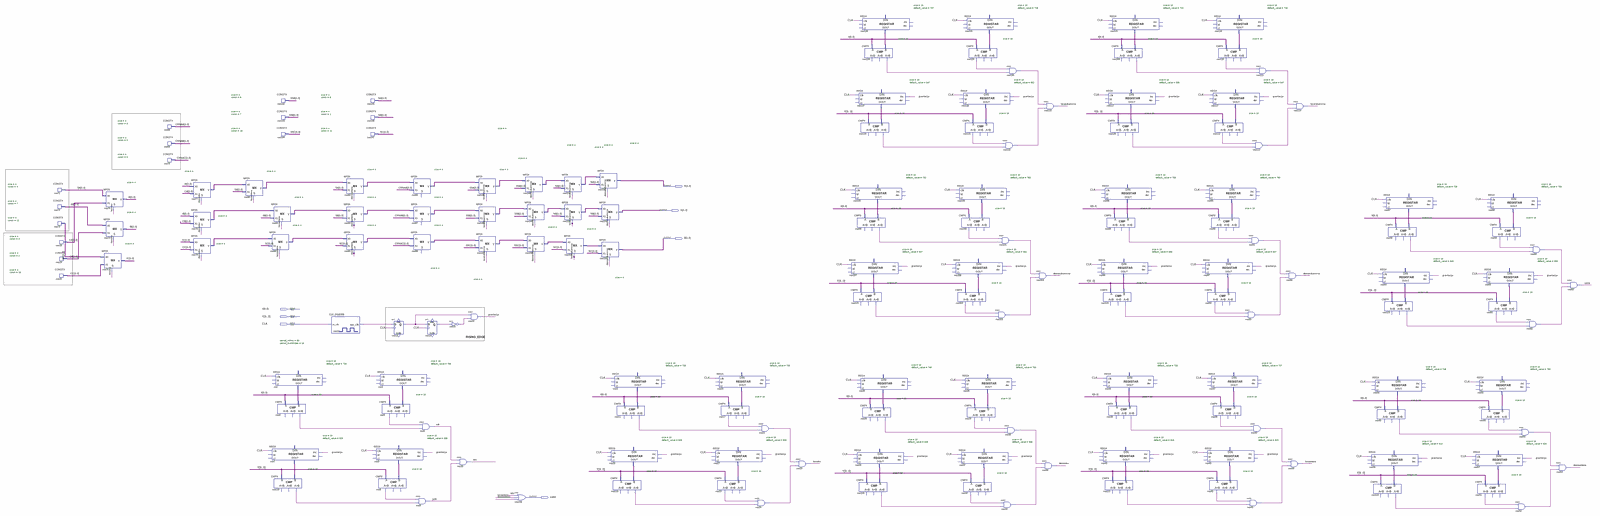
[diagram p0: schematic sheet, whole]
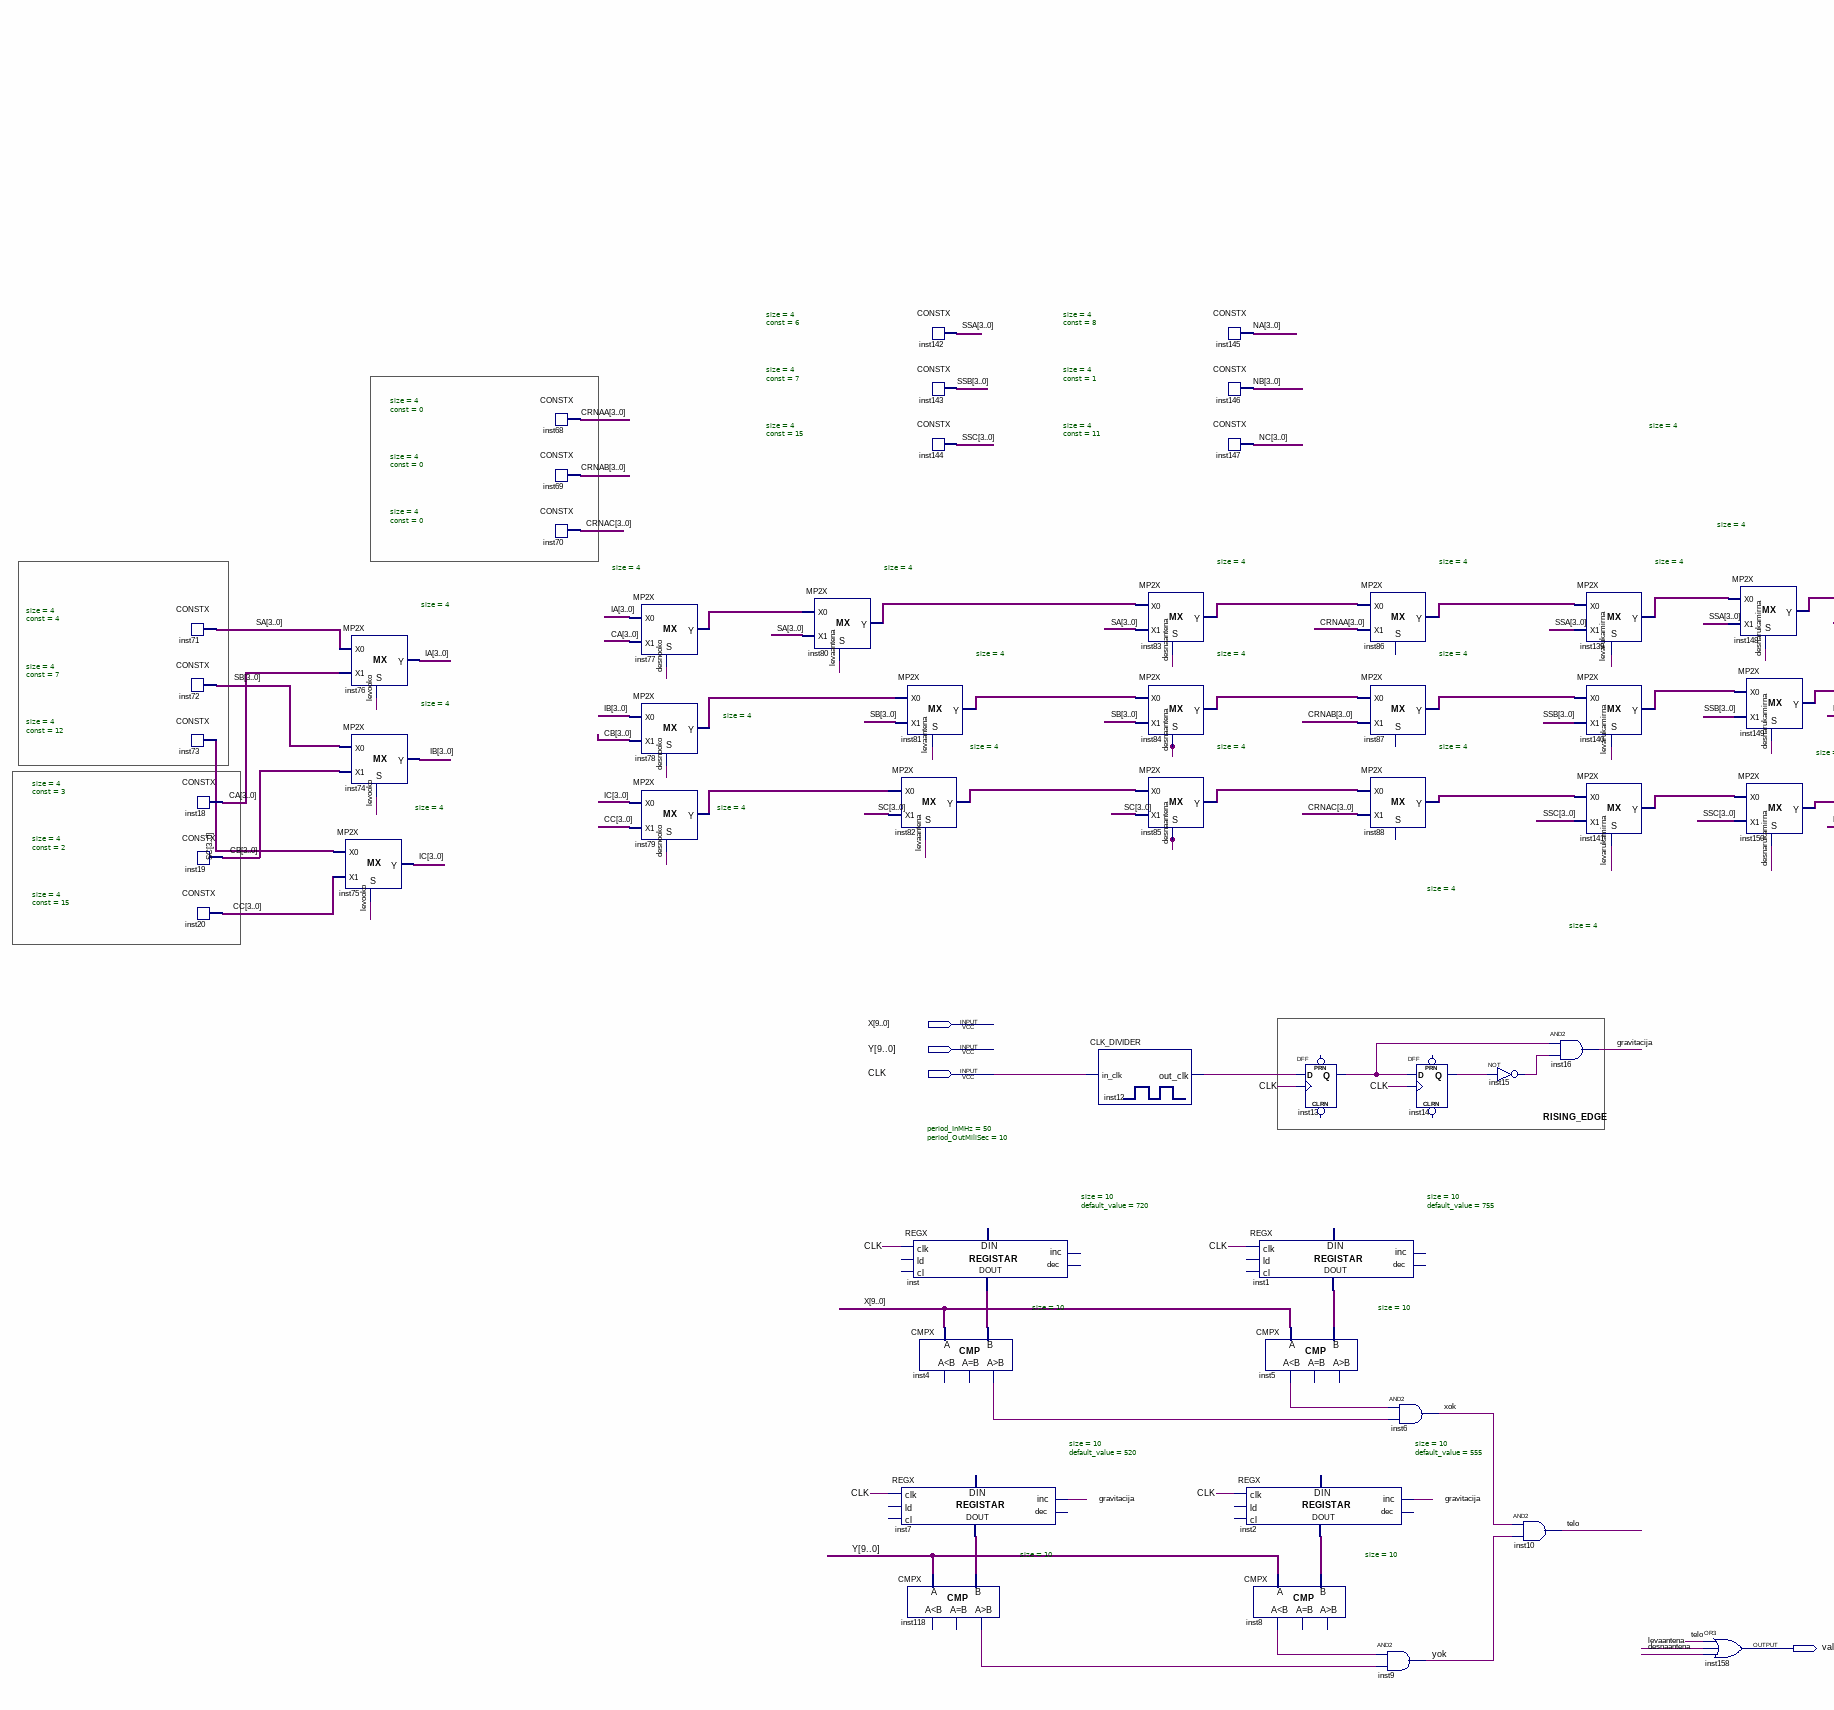
[diagram p1: schematic sheet, left part]
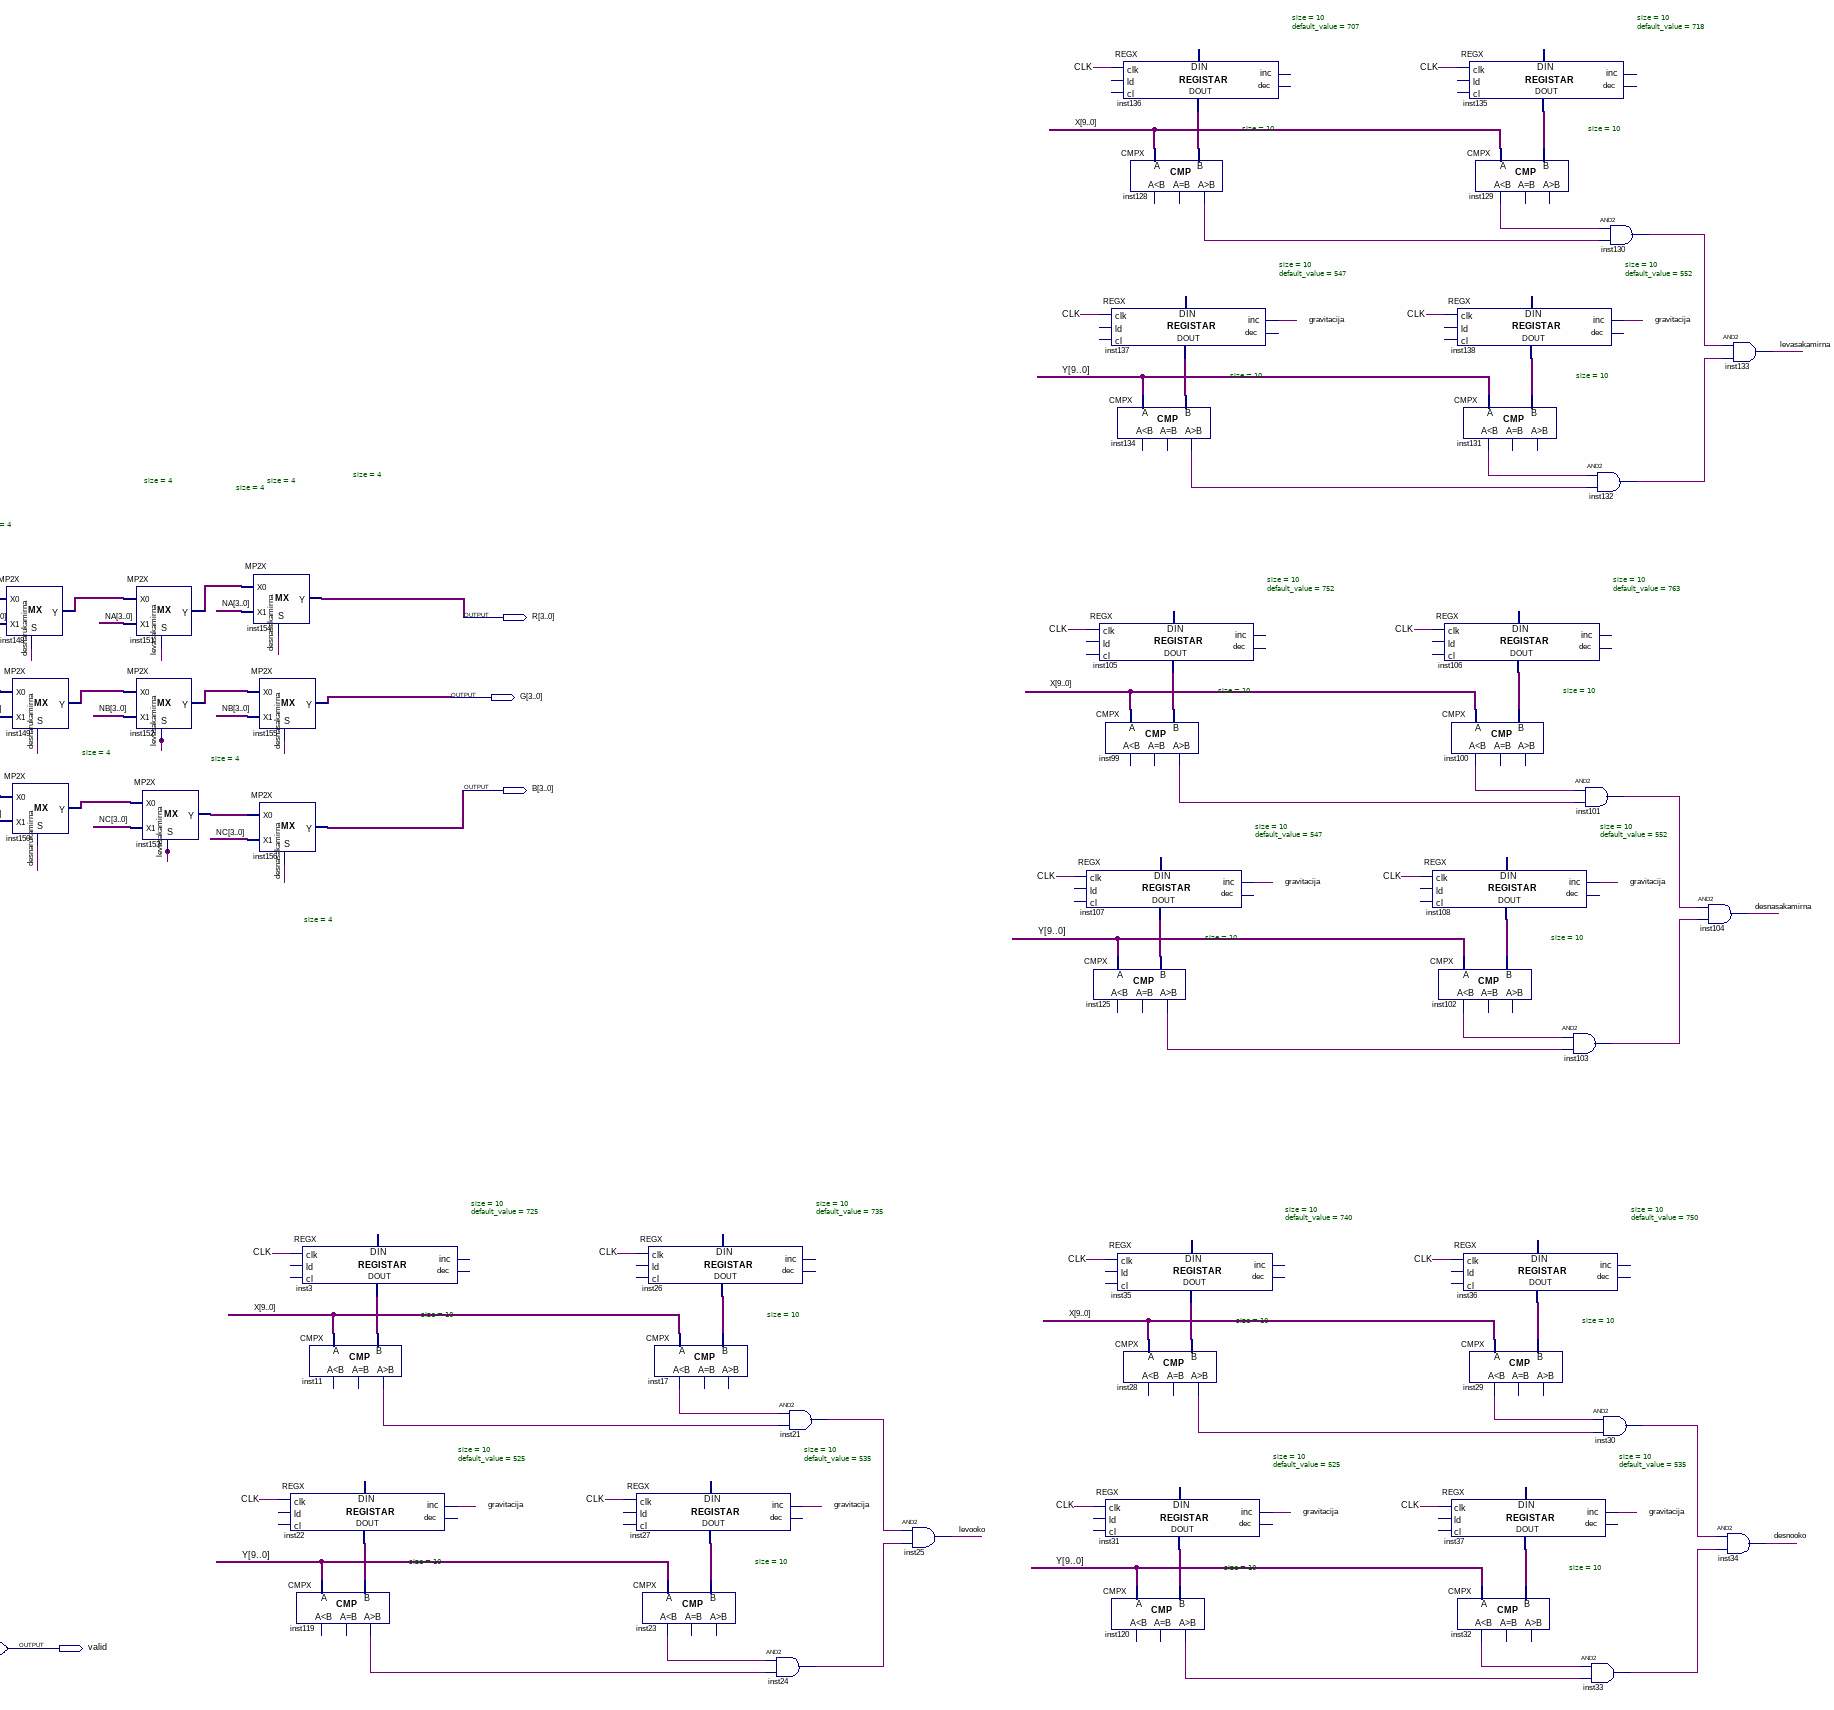
[diagram p2: schematic sheet, centre part]
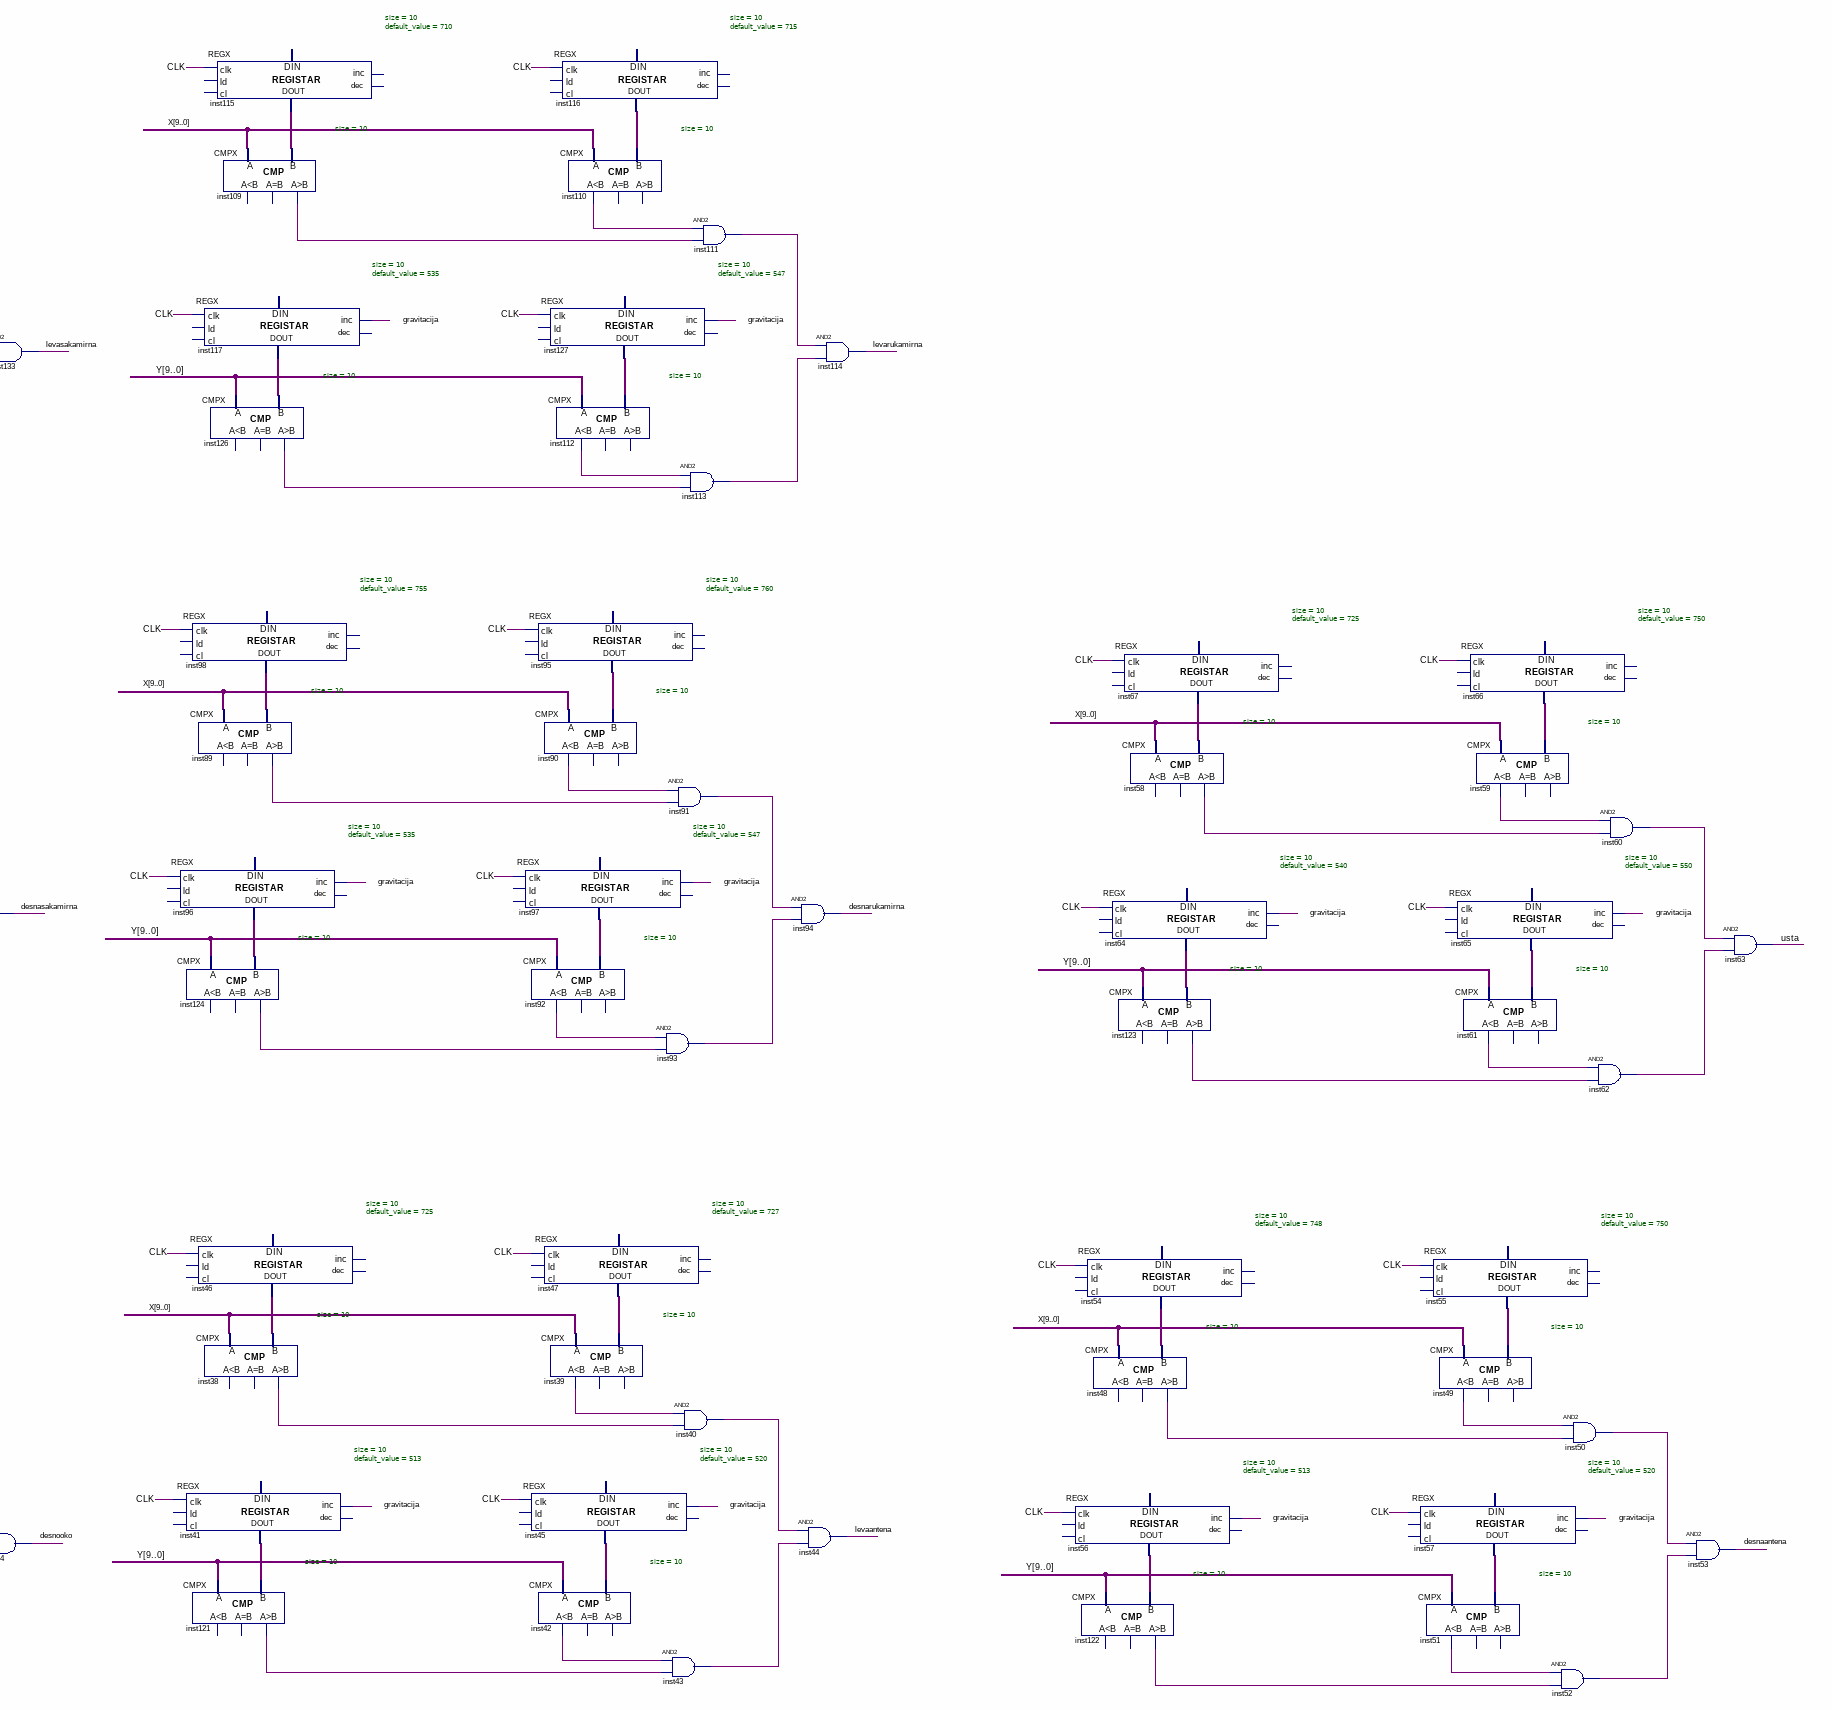
[diagram p3: schematic sheet, right part]
// Quartus schematic Robot2.bdf as structural Verilog: 158 symbols, 7 pins
module Robot2 (
  input  [9:0] X,
  input  [9:0] Y,
  input  CLK,
  output [3:0] R,
  output [3:0] G,
  output [3:0] B,
  output valid
);

  wire desnaantena, desnarukamirna, desnasakamirna, desnooko, gravitacija, inst4_gr, inst5_ls, inst8_ls,
       inst11_gr, inst12_out_clk, inst13_q, inst14_q, inst15_out, inst17_ls, inst21_out, inst23_ls,
       inst24_out, inst28_gr, inst29_ls, inst30_out, inst32_ls, inst33_out, inst38_gr, inst39_ls, inst40_out,
       inst42_ls, inst43_out, inst48_gr, inst49_ls, inst50_out, inst51_ls, inst52_out, inst58_gr, inst59_ls,
       inst60_out, inst61_ls, inst62_out, inst89_gr, inst90_ls, inst91_out, inst92_ls, inst93_out, inst99_gr,
       inst100_ls, inst101_out, inst102_ls, inst103_out, inst109_gr, inst110_ls, inst111_out, inst112_ls,
       inst113_out, inst118_gr, inst119_gr, inst120_gr, inst121_gr, inst122_gr, inst123_gr, inst124_gr,
       inst125_gr, inst126_gr, inst128_gr, inst129_ls, inst130_out, inst131_ls, inst132_out, inst134_gr,
       levaantena, levarukamirna, levasakamirna, levooko, telo, usta, xok, yok;
  wire [3:0] CA, CB, CC, CRNAA, CRNAB, CRNAC, IA, IB, IC, inst77_y, inst78_y, inst79_y, inst80_y, inst81_y,
       inst82_y, inst83_y, inst84_y, inst85_y, inst86_y, inst87_y, inst88_y, inst139_y, inst140_y, inst141_y,
       inst148_y, inst149_y, inst150_y, inst151_y, inst152_y, inst153_y, NA, NB, NC, SA, SB, SC, SSA, SSB,
       SSC;
  wire [9:0] inst1_data_out, inst2_data_out, inst3_data_out, inst7_data_out, inst22_data_out,
       inst26_data_out, inst27_data_out, inst31_data_out, inst35_data_out, inst36_data_out, inst37_data_out,
       inst41_data_out, inst45_data_out, inst46_data_out, inst47_data_out, inst54_data_out, inst55_data_out,
       inst56_data_out, inst57_data_out, inst64_data_out, inst65_data_out, inst66_data_out, inst67_data_out,
       inst95_data_out, inst96_data_out, inst97_data_out, inst98_data_out, inst105_data_out,
       inst106_data_out, inst107_data_out, inst108_data_out, inst115_data_out, inst116_data_out,
       inst117_data_out, inst127_data_out, inst135_data_out, inst136_data_out, inst137_data_out,
       inst138_data_out, inst_data_out;

  CONSTX #(.size(4), .\const (4)) inst71 (.data(SA));
  CONSTX #(.size(4), .\const (7)) inst72 (.data(SB));
  CONSTX #(.size(4), .\const (12)) inst73 (.data(SC));
  CONSTX #(.size(4), .\const (3)) inst18 (.data(CA));
  CONSTX #(.size(4), .\const (2)) inst19 (.data(CB));
  CONSTX #(.size(4), .\const (15)) inst20 (.data(CC));
  MP2X #(.size(4)) inst76 (.S(levooko), .X0(SA), .X1(CA), .Y(IA));
  MP2X #(.size(4)) inst74 (.S(levooko), .X0(SB), .X1(CB), .Y(IB));
  MP2X #(.size(4)) inst75 (.S(levooko), .X0(SC), .X1(CC), .Y(IC));
  CONSTX #(.size(4), .\const (0)) inst68 (.data(CRNAA));
  CONSTX #(.size(4), .\const (0)) inst69 (.data(CRNAB));
  CONSTX #(.size(4), .\const (0)) inst70 (.data(CRNAC));
  MP2X #(.size(4)) inst77 (.S(desnooko), .X0(IA), .X1(CA), .Y(inst77_y));
  MP2X #(.size(4)) inst78 (.S(desnooko), .X0(IB), .X1(CB), .Y(inst78_y));
  MP2X #(.size(4)) inst79 (.S(desnooko), .X0(IC), .X1(CC), .Y(inst79_y));
  MP2X #(.size(4)) inst80 (.S(levaantena), .X0(inst77_y), .X1(SA), .Y(inst80_y));
  CONSTX #(.size(4), .\const (6)) inst142 (.data(SSA));
  CONSTX #(.size(4), .\const (7)) inst143 (.data(SSB));
  CONSTX #(.size(4), .\const (15)) inst144 (.data(SSC));
  MP2X #(.size(4)) inst81 (.S(levaantena), .X0(inst78_y), .X1(SB), .Y(inst81_y));
  MP2X #(.size(4)) inst82 (.S(levaantena), .X0(inst79_y), .X1(SC), .Y(inst82_y));
  REGX #(.size(10), .default_value(720)) inst (.clk(CLK), .data_out(inst_data_out));  // open: ld, cl, inc, dec, data_in
  CMPX #(.size(10)) inst4 (.A(X), .B(inst_data_out), .gr(inst4_gr));  // open: ls, eq
  REGX #(.size(10), .default_value(520)) inst7 (
    .clk(CLK), .inc(gravitacija), .data_out(inst7_data_out));  // open: ld, cl, dec, data_in
  CMPX #(.size(10)) inst118 (.A(Y), .B(inst7_data_out), .gr(inst118_gr));  // open: ls, eq
  CLK_DIVIDER #(.period_InMHz(50), .period_OutMiliSec(10)) inst12 (.in_clk(CLK), .out_clk(inst12_out_clk));
  MP2X #(.size(4)) inst83 (.S(desnaantena), .X0(inst80_y), .X1(SA), .Y(inst83_y));
  MP2X #(.size(4)) inst84 (.S(desnaantena), .X0(inst81_y), .X1(SB), .Y(inst84_y));
  MP2X #(.size(4)) inst85 (.S(desnaantena), .X0(inst82_y), .X1(SC), .Y(inst85_y));
  CONSTX #(.size(4), .\const (8)) inst145 (.data(NA));
  CONSTX #(.size(4), .\const (1)) inst146 (.data(NB));
  CONSTX #(.size(4), .\const (11)) inst147 (.data(NC));
  REGX #(.size(10), .default_value(755)) inst1 (
    .clk(CLK), .data_out(inst1_data_out));  // open: ld, cl, inc, dec, data_in
  CMPX #(.size(10)) inst5 (.A(X), .B(inst1_data_out), .ls(inst5_ls));  // open: eq, gr
  REGX #(.size(10), .default_value(555)) inst2 (
    .clk(CLK), .inc(gravitacija), .data_out(inst2_data_out));  // open: ld, cl, dec, data_in
  CMPX #(.size(10)) inst8 (.A(Y), .B(inst2_data_out), .ls(inst8_ls));  // open: eq, gr
  DFF inst13 (.CLK(CLK), .D(inst12_out_clk), .Q(inst13_q));  // open: CLRN, PRN
  MP2X #(.size(4)) inst86 (.X0(inst83_y), .X1(CRNAA), .Y(inst86_y));  // open: S
  MP2X #(.size(4)) inst87 (.X0(inst84_y), .X1(CRNAB), .Y(inst87_y));  // open: S
  MP2X #(.size(4)) inst88 (.X0(inst85_y), .X1(CRNAC), .Y(inst88_y));  // open: S
  and inst9 (yok, inst8_ls, inst118_gr);
  DFF inst14 (.CLK(CLK), .D(inst13_q), .Q(inst14_q));  // open: CLRN, PRN
  and inst6 (xok, inst5_ls, inst4_gr);
  not inst15 (inst15_out, inst14_q);
  and inst10 (telo, xok, yok);
  MP2X #(.size(4)) inst139 (.S(levarukamirna), .X0(inst86_y), .X1(SSA), .Y(inst139_y));
  MP2X #(.size(4)) inst140 (.S(levarukamirna), .X0(inst87_y), .X1(SSB), .Y(inst140_y));
  MP2X #(.size(4)) inst141 (.S(levarukamirna), .X0(inst88_y), .X1(SSC), .Y(inst141_y));
  and inst16 (gravitacija, inst13_q, inst15_out);
  or inst158 (valid, telo, levaantena, desnaantena);
  MP2X #(.size(4)) inst148 (.S(desnarukamirna), .X0(inst139_y), .X1(SSA), .Y(inst148_y));
  MP2X #(.size(4)) inst149 (.S(desnarukamirna), .X0(inst140_y), .X1(SSB), .Y(inst149_y));
  MP2X #(.size(4)) inst150 (.S(desnarukamirna), .X0(inst141_y), .X1(SSC), .Y(inst150_y));
  MP2X #(.size(4)) inst151 (.S(levasakamirna), .X0(inst148_y), .X1(NA), .Y(inst151_y));
  MP2X #(.size(4)) inst152 (.S(levasakamirna), .X0(inst149_y), .X1(NB), .Y(inst152_y));
  MP2X #(.size(4)) inst153 (.S(levasakamirna), .X0(inst150_y), .X1(NC), .Y(inst153_y));
  MP2X #(.size(4)) inst154 (.S(desnasakamirna), .X0(inst151_y), .X1(NA), .Y(R));
  MP2X #(.size(4)) inst155 (.S(desnasakamirna), .X0(inst152_y), .X1(NB), .Y(G));
  MP2X #(.size(4)) inst156 (.S(desnasakamirna), .X0(inst153_y), .X1(NC), .Y(B));
  REGX #(.size(10), .default_value(525)) inst22 (
    .clk(CLK), .inc(gravitacija), .data_out(inst22_data_out));  // open: ld, cl, dec, data_in
  CMPX #(.size(10)) inst119 (.A(Y), .B(inst22_data_out), .gr(inst119_gr));  // open: ls, eq
  REGX #(.size(10), .default_value(725)) inst3 (
    .clk(CLK), .data_out(inst3_data_out));  // open: ld, cl, inc, dec, data_in
  CMPX #(.size(10)) inst11 (.A(X), .B(inst3_data_out), .gr(inst11_gr));  // open: ls, eq
  REGX #(.size(10), .default_value(535)) inst27 (
    .clk(CLK), .inc(gravitacija), .data_out(inst27_data_out));  // open: ld, cl, dec, data_in
  CMPX #(.size(10)) inst23 (.A(Y), .B(inst27_data_out), .ls(inst23_ls));  // open: eq, gr
  REGX #(.size(10), .default_value(735)) inst26 (
    .clk(CLK), .data_out(inst26_data_out));  // open: ld, cl, inc, dec, data_in
  CMPX #(.size(10)) inst17 (.A(X), .B(inst26_data_out), .ls(inst17_ls));  // open: eq, gr
  and inst21 (inst21_out, inst17_ls, inst11_gr);
  and inst24 (inst24_out, inst23_ls, inst119_gr);
  and inst25 (levooko, inst21_out, inst24_out);
  REGX #(.size(10), .default_value(547)) inst107 (
    .clk(CLK), .inc(gravitacija), .data_out(inst107_data_out));  // open: ld, cl, dec, data_in
  REGX #(.size(10), .default_value(707)) inst136 (
    .clk(CLK), .data_out(inst136_data_out));  // open: ld, cl, inc, dec, data_in
  CMPX #(.size(10)) inst128 (.A(X), .B(inst136_data_out), .gr(inst128_gr));  // open: ls, eq
  REGX #(.size(10), .default_value(547)) inst137 (
    .clk(CLK), .inc(gravitacija), .data_out(inst137_data_out));  // open: ld, cl, dec, data_in
  CMPX #(.size(10)) inst134 (.A(Y), .B(inst137_data_out), .gr(inst134_gr));  // open: ls, eq
  REGX #(.size(10), .default_value(752)) inst105 (
    .clk(CLK), .data_out(inst105_data_out));  // open: ld, cl, inc, dec, data_in
  CMPX #(.size(10)) inst99 (.A(X), .B(inst105_data_out), .gr(inst99_gr));  // open: ls, eq
  CMPX #(.size(10)) inst125 (.A(Y), .B(inst107_data_out), .gr(inst125_gr));  // open: ls, eq
  REGX #(.size(10), .default_value(740)) inst35 (
    .clk(CLK), .data_out(inst35_data_out));  // open: ld, cl, inc, dec, data_in
  CMPX #(.size(10)) inst28 (.A(X), .B(inst35_data_out), .gr(inst28_gr));  // open: ls, eq
  REGX #(.size(10), .default_value(525)) inst31 (
    .clk(CLK), .inc(gravitacija), .data_out(inst31_data_out));  // open: ld, cl, dec, data_in
  CMPX #(.size(10)) inst120 (.A(Y), .B(inst31_data_out), .gr(inst120_gr));  // open: ls, eq
  REGX #(.size(10), .default_value(552)) inst108 (
    .clk(CLK), .inc(gravitacija), .data_out(inst108_data_out));  // open: ld, cl, dec, data_in
  REGX #(.size(10), .default_value(718)) inst135 (
    .clk(CLK), .data_out(inst135_data_out));  // open: ld, cl, inc, dec, data_in
  CMPX #(.size(10)) inst129 (.A(X), .B(inst135_data_out), .ls(inst129_ls));  // open: eq, gr
  REGX #(.size(10), .default_value(552)) inst138 (
    .clk(CLK), .inc(gravitacija), .data_out(inst138_data_out));  // open: ld, cl, dec, data_in
  CMPX #(.size(10)) inst131 (.A(Y), .B(inst138_data_out), .ls(inst131_ls));  // open: eq, gr
  REGX #(.size(10), .default_value(763)) inst106 (
    .clk(CLK), .data_out(inst106_data_out));  // open: ld, cl, inc, dec, data_in
  CMPX #(.size(10)) inst100 (.A(X), .B(inst106_data_out), .ls(inst100_ls));  // open: eq, gr
  CMPX #(.size(10)) inst102 (.A(Y), .B(inst108_data_out), .ls(inst102_ls));  // open: eq, gr
  REGX #(.size(10), .default_value(750)) inst36 (
    .clk(CLK), .data_out(inst36_data_out));  // open: ld, cl, inc, dec, data_in
  CMPX #(.size(10)) inst29 (.A(X), .B(inst36_data_out), .ls(inst29_ls));  // open: eq, gr
  REGX #(.size(10), .default_value(535)) inst37 (
    .clk(CLK), .inc(gravitacija), .data_out(inst37_data_out));  // open: ld, cl, dec, data_in
  CMPX #(.size(10)) inst32 (.A(Y), .B(inst37_data_out), .ls(inst32_ls));  // open: eq, gr
  and inst103 (inst103_out, inst102_ls, inst125_gr);
  and inst130 (inst130_out, inst129_ls, inst128_gr);
  and inst132 (inst132_out, inst131_ls, inst134_gr);
  and inst101 (inst101_out, inst100_ls, inst99_gr);
  and inst30 (inst30_out, inst29_ls, inst28_gr);
  and inst33 (inst33_out, inst32_ls, inst120_gr);
  and inst104 (desnasakamirna, inst101_out, inst103_out);
  and inst34 (desnooko, inst30_out, inst33_out);
  and inst133 (levasakamirna, inst130_out, inst132_out);
  REGX #(.size(10), .default_value(755)) inst98 (
    .clk(CLK), .data_out(inst98_data_out));  // open: ld, cl, inc, dec, data_in
  REGX #(.size(10), .default_value(535)) inst96 (
    .clk(CLK), .inc(gravitacija), .data_out(inst96_data_out));  // open: ld, cl, dec, data_in
  CMPX #(.size(10)) inst124 (.A(Y), .B(inst96_data_out), .gr(inst124_gr));  // open: ls, eq
  REGX #(.size(10), .default_value(513)) inst41 (
    .clk(CLK), .inc(gravitacija), .data_out(inst41_data_out));  // open: ld, cl, dec, data_in
  CMPX #(.size(10)) inst121 (.A(Y), .B(inst41_data_out), .gr(inst121_gr));  // open: ls, eq
  REGX #(.size(10), .default_value(710)) inst115 (
    .clk(CLK), .data_out(inst115_data_out));  // open: ld, cl, inc, dec, data_in
  CMPX #(.size(10)) inst109 (.A(X), .B(inst115_data_out), .gr(inst109_gr));  // open: ls, eq
  REGX #(.size(10), .default_value(535)) inst117 (
    .clk(CLK), .inc(gravitacija), .data_out(inst117_data_out));  // open: ld, cl, dec, data_in
  CMPX #(.size(10)) inst126 (.A(Y), .B(inst117_data_out), .gr(inst126_gr));  // open: ls, eq
  CMPX #(.size(10)) inst89 (.A(X), .B(inst98_data_out), .gr(inst89_gr));  // open: ls, eq
  REGX #(.size(10), .default_value(725)) inst46 (
    .clk(CLK), .data_out(inst46_data_out));  // open: ld, cl, inc, dec, data_in
  CMPX #(.size(10)) inst38 (.A(X), .B(inst46_data_out), .gr(inst38_gr));  // open: ls, eq
  REGX #(.size(10), .default_value(760)) inst95 (
    .clk(CLK), .data_out(inst95_data_out));  // open: ld, cl, inc, dec, data_in
  REGX #(.size(10), .default_value(547)) inst97 (
    .clk(CLK), .inc(gravitacija), .data_out(inst97_data_out));  // open: ld, cl, dec, data_in
  CMPX #(.size(10)) inst92 (.A(Y), .B(inst97_data_out), .ls(inst92_ls));  // open: eq, gr
  REGX #(.size(10), .default_value(520)) inst45 (
    .clk(CLK), .inc(gravitacija), .data_out(inst45_data_out));  // open: ld, cl, dec, data_in
  CMPX #(.size(10)) inst42 (.A(Y), .B(inst45_data_out), .ls(inst42_ls));  // open: eq, gr
  REGX #(.size(10), .default_value(715)) inst116 (
    .clk(CLK), .data_out(inst116_data_out));  // open: ld, cl, inc, dec, data_in
  CMPX #(.size(10)) inst110 (.A(X), .B(inst116_data_out), .ls(inst110_ls));  // open: eq, gr
  REGX #(.size(10), .default_value(547)) inst127 (
    .clk(CLK), .inc(gravitacija), .data_out(inst127_data_out));  // open: ld, cl, dec, data_in
  CMPX #(.size(10)) inst112 (.A(Y), .B(inst127_data_out), .ls(inst112_ls));  // open: eq, gr
  CMPX #(.size(10)) inst90 (.A(X), .B(inst95_data_out), .ls(inst90_ls));  // open: eq, gr
  REGX #(.size(10), .default_value(727)) inst47 (
    .clk(CLK), .data_out(inst47_data_out));  // open: ld, cl, inc, dec, data_in
  CMPX #(.size(10)) inst39 (.A(X), .B(inst47_data_out), .ls(inst39_ls));  // open: eq, gr
  and inst91 (inst91_out, inst90_ls, inst89_gr);
  and inst93 (inst93_out, inst92_ls, inst124_gr);
  and inst40 (inst40_out, inst39_ls, inst38_gr);
  and inst43 (inst43_out, inst42_ls, inst121_gr);
  and inst111 (inst111_out, inst110_ls, inst109_gr);
  and inst113 (inst113_out, inst112_ls, inst126_gr);
  and inst114 (levarukamirna, inst111_out, inst113_out);
  and inst94 (desnarukamirna, inst91_out, inst93_out);
  and inst44 (levaantena, inst40_out, inst43_out);
  REGX #(.size(10), .default_value(513)) inst56 (
    .clk(CLK), .inc(gravitacija), .data_out(inst56_data_out));  // open: ld, cl, dec, data_in
  CMPX #(.size(10)) inst122 (.A(Y), .B(inst56_data_out), .gr(inst122_gr));  // open: ls, eq
  REGX #(.size(10), .default_value(725)) inst67 (
    .clk(CLK), .data_out(inst67_data_out));  // open: ld, cl, inc, dec, data_in
  CMPX #(.size(10)) inst58 (.A(X), .B(inst67_data_out), .gr(inst58_gr));  // open: ls, eq
  REGX #(.size(10), .default_value(540)) inst64 (
    .clk(CLK), .inc(gravitacija), .data_out(inst64_data_out));  // open: ld, cl, dec, data_in
  CMPX #(.size(10)) inst123 (.A(Y), .B(inst64_data_out), .gr(inst123_gr));  // open: ls, eq
  REGX #(.size(10), .default_value(748)) inst54 (
    .clk(CLK), .data_out(inst54_data_out));  // open: ld, cl, inc, dec, data_in
  CMPX #(.size(10)) inst48 (.A(X), .B(inst54_data_out), .gr(inst48_gr));  // open: ls, eq
  REGX #(.size(10), .default_value(520)) inst57 (
    .clk(CLK), .inc(gravitacija), .data_out(inst57_data_out));  // open: ld, cl, dec, data_in
  CMPX #(.size(10)) inst51 (.A(Y), .B(inst57_data_out), .ls(inst51_ls));  // open: eq, gr
  REGX #(.size(10), .default_value(750)) inst66 (
    .clk(CLK), .data_out(inst66_data_out));  // open: ld, cl, inc, dec, data_in
  CMPX #(.size(10)) inst59 (.A(X), .B(inst66_data_out), .ls(inst59_ls));  // open: eq, gr
  REGX #(.size(10), .default_value(550)) inst65 (
    .clk(CLK), .inc(gravitacija), .data_out(inst65_data_out));  // open: ld, cl, dec, data_in
  CMPX #(.size(10)) inst61 (.A(Y), .B(inst65_data_out), .ls(inst61_ls));  // open: eq, gr
  REGX #(.size(10), .default_value(750)) inst55 (
    .clk(CLK), .data_out(inst55_data_out));  // open: ld, cl, inc, dec, data_in
  CMPX #(.size(10)) inst49 (.A(X), .B(inst55_data_out), .ls(inst49_ls));  // open: eq, gr
  and inst50 (inst50_out, inst49_ls, inst48_gr);
  and inst52 (inst52_out, inst51_ls, inst122_gr);
  and inst60 (inst60_out, inst59_ls, inst58_gr);
  and inst62 (inst62_out, inst61_ls, inst123_gr);
  and inst53 (desnaantena, inst50_out, inst52_out);
  and inst63 (usta, inst60_out, inst62_out);

  // Notes on the sheet:
  //   RISING_EDGE
endmodule
